# EasyEDA schematic SCH_SOFT-LIGHTS (1).json
TITLE: Sheet_1; REV: 1.0; Date: 2025-07-21; Sheet: 1/1; Company: MECH GIANTS
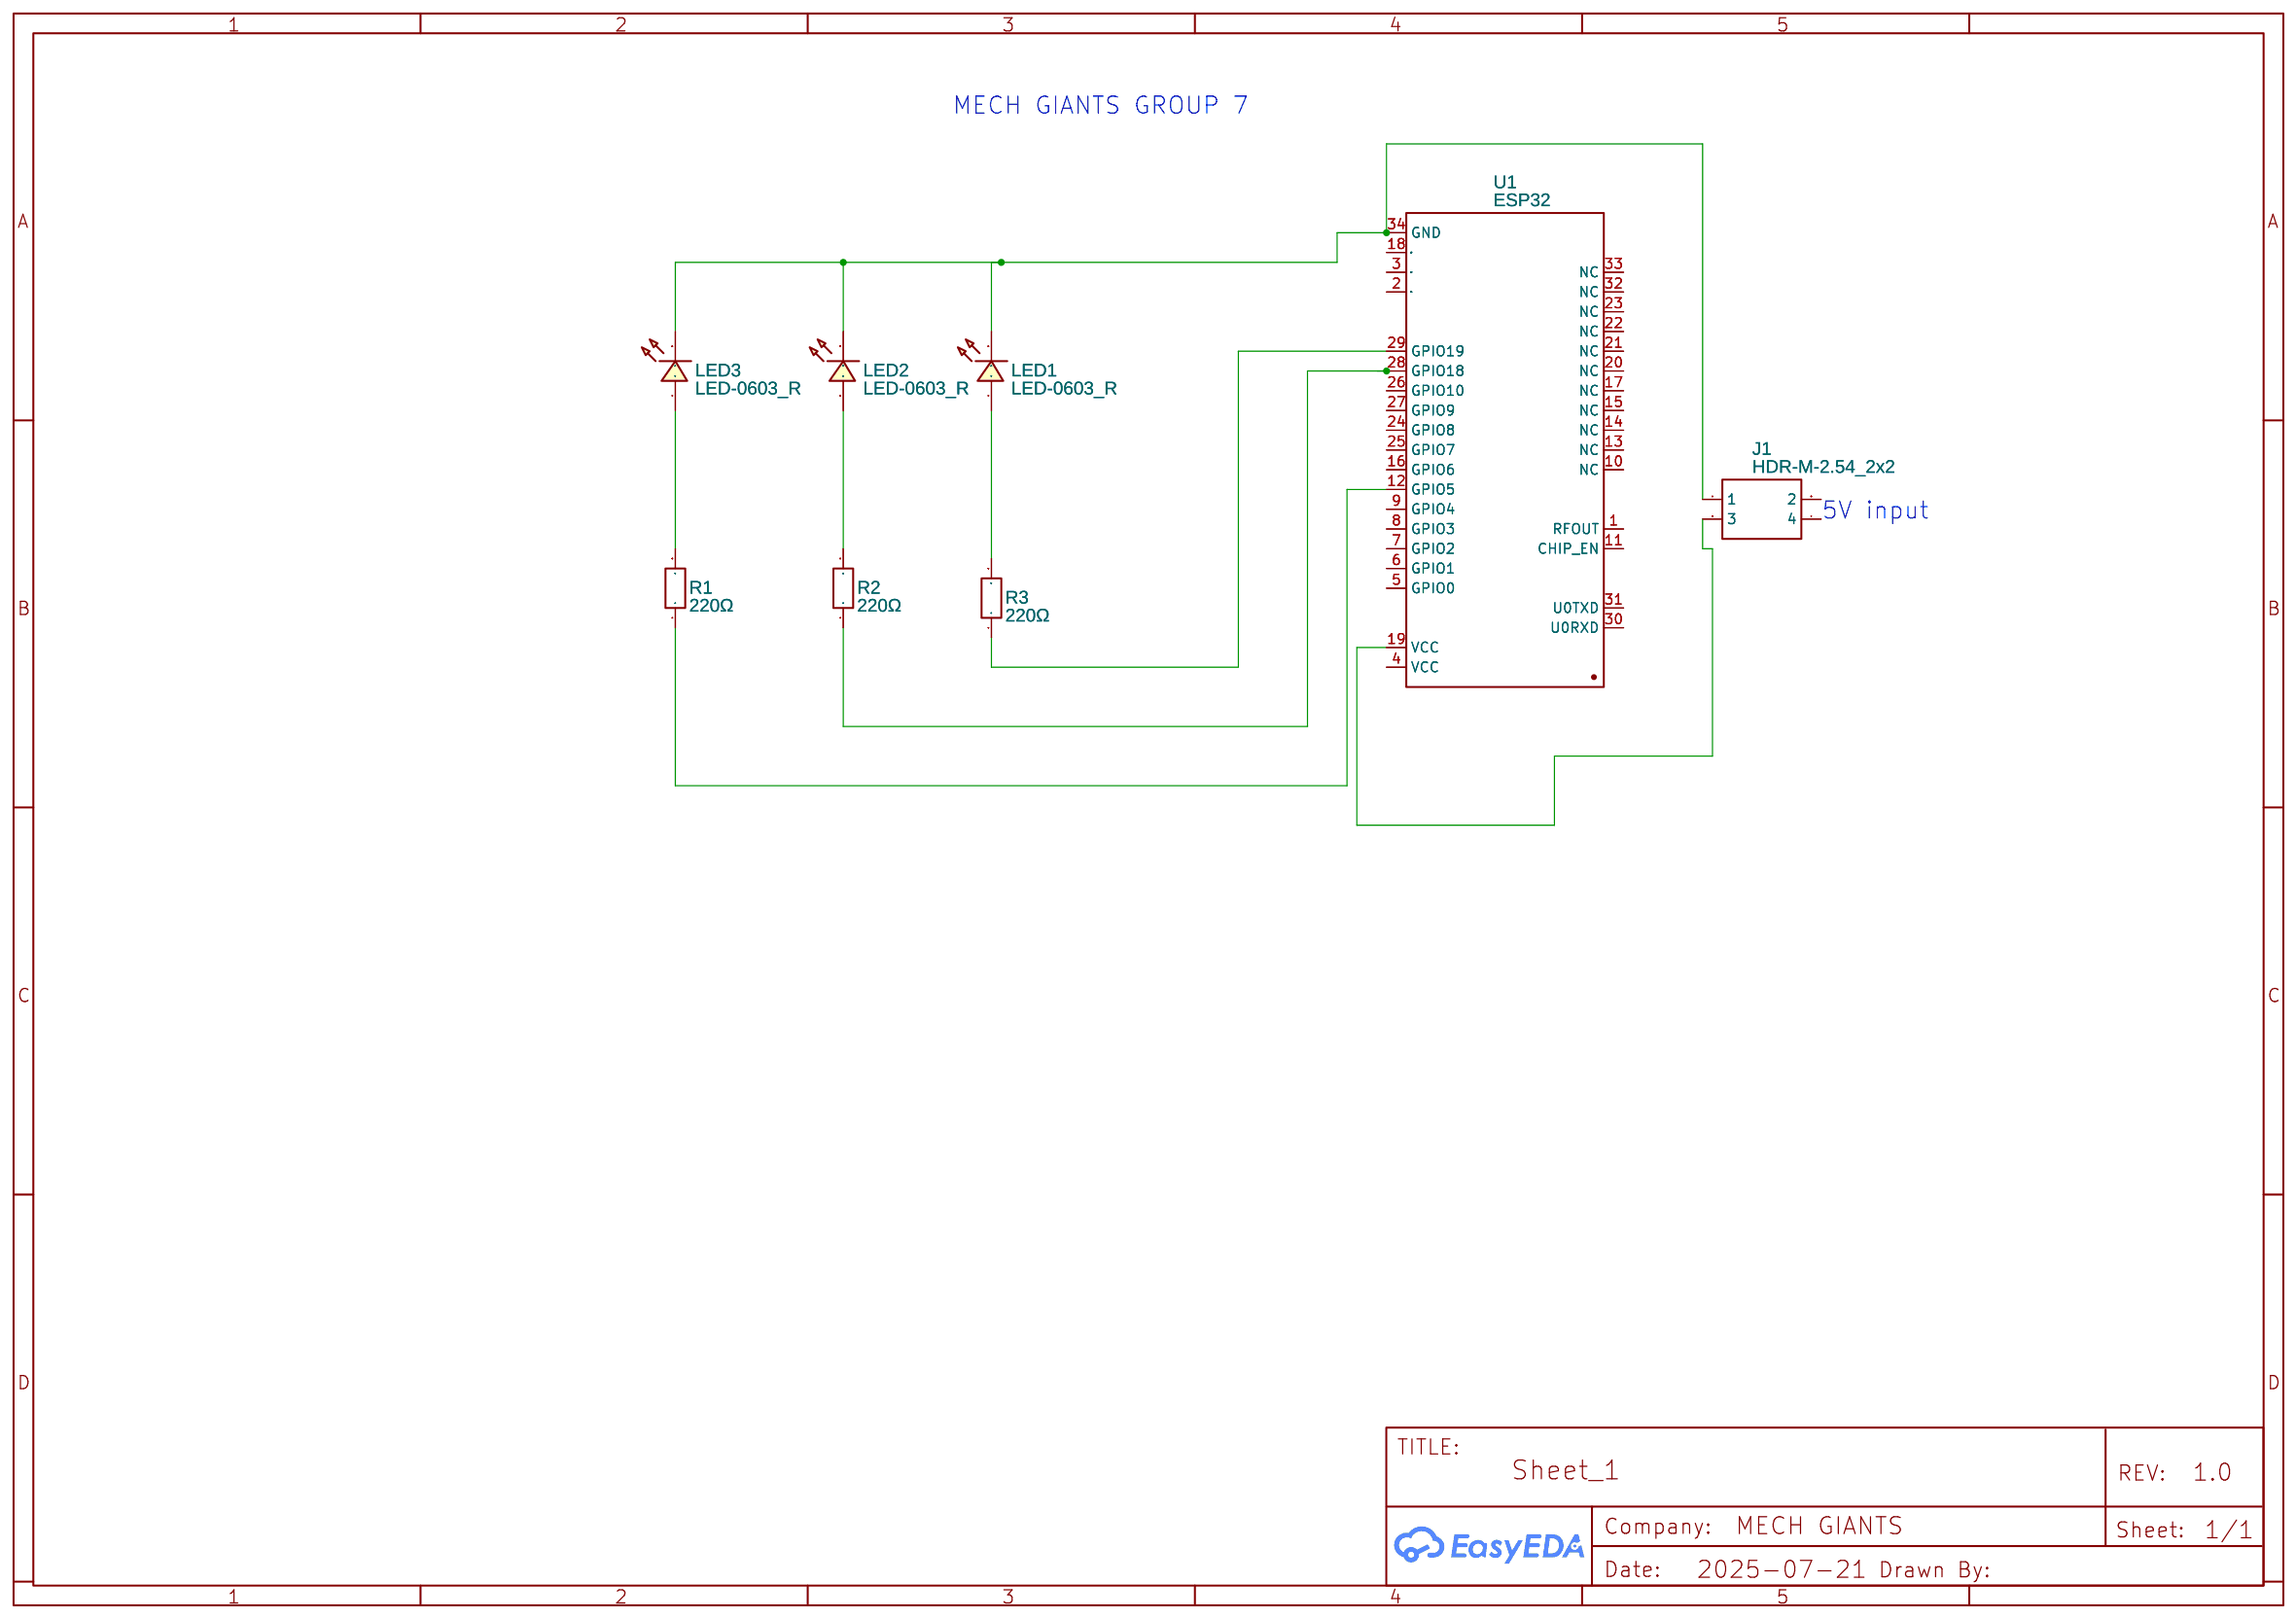
[diagram p0: schematic sheet]

## Parts
J1  HDR-M-2.54_2x2  [HDR-M-2.54_2X2]
LED1  LED-0603_R  [LED0603_RED]
LED2  LED-0603_R  [LED0603_RED]
LED3  LED-0603_R  [LED0603_RED]
R1  220Ω  [RES-SMD_BD1.4-L3.5]
R2  220Ω  [RES-SMD_BD1.4-L3.5]
R3  220Ω  [RES-SMD_BD1.4-L3.5]
U1  ESP32  [WIRELM-SMD_RF-WM-ESP32B1]

## Library data of the parts
J1 = HDR-M-2.54_2x2: Supplier Part: C66690; Supplier: LCSC; Contributor: LCEDA_Lib
LED1-LED3 = LED-0603_R: Manufacturer: EVERLIGHT(台湾亿光); Manufacturer Part: 19-217/R6C-AL1M2VY/3T; Supplier Part: C72044; Supplier: LCSC; Contributor: LCEDA_01
R1-R3 = MM204VF220RTKRTR3K0: Contributor: lcsc; Supplier: LCSC; Supplier Part: C916025; Manufacturer: Firstohm(第一电阻); JLCPCB Part Class: Extended Part
U1 = RF-WM-ESP32B1: Supplier: LCSC; Supplier Part: C18213519; Manufacturer: RF-star(信驰达); JLCPCB Part Class: Extended Part; Contributor: lcsc

## Nets
Net-(J1-1): J1.1 LED1.2 LED2.2 LED3.2 U1.34(GND)
Net-(J1-3): J1.3 U1.19(VCC)
Net-(LED1-1): LED1.1 R3.2
Net-(LED2-1): LED2.1 R2.2
Net-(LED3-1): LED3.1 R1.2
Net-(R1-1): R1.1 U1.12(GPIO5)
Net-(R2-1): R2.1 U1.28(GPIO18)
Net-(R3-1): R3.1 U1.29(GPIO19)

Not connected (* = marked no-connect by the designer): J1 2 4; U1 1(RFOUT) 2(GND) 3(GND) 4(VCC) 5(GPIO0) 6(GPIO1) 7(GPIO2) 8(GPIO3) 9(GPIO4) 10(NC) 11(CHIP_EN) 13(NC) 14(NC) 15(NC) 16(GPIO6) 17(NC) 18(GND) 20(NC) 21(NC) 22(NC) 23(NC) 24(GPIO8) 25(GPIO7) 26(GPIO10) 27(GPIO9) 30(U0RXD) 31(U0TXD) 32(NC) 33(NC)

## Notes on the sheet
- MECH GIANTS GROUP 7
- 5V input
